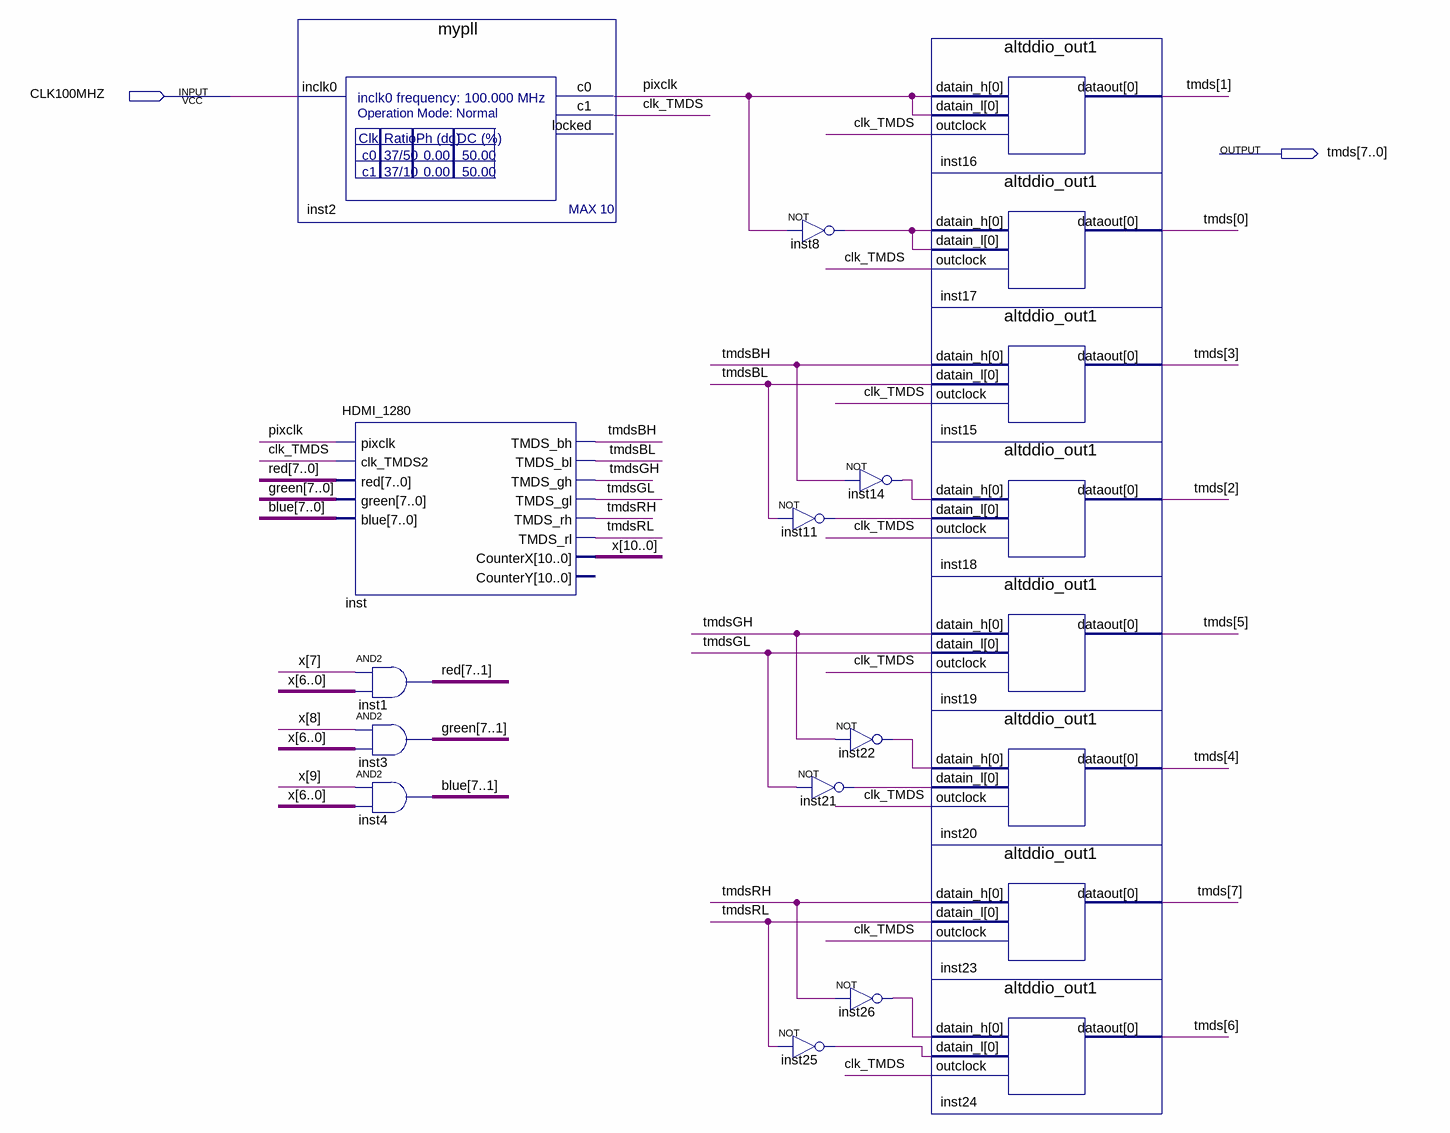
[diagram p0: schematic sheet]
// Quartus schematic max10.bdf as structural Verilog: 20 symbols, 2 pins
module max10 (
  input  CLK100MHZ,
  output [7:0] tmds
);

  wire clk_TMDS, inst8_out, inst11_out, inst14_out, inst21_out, inst22_out, inst25_out, inst26_out, pixclk,
       tmdsBH, tmdsBL, tmdsGH, tmdsGL, tmdsRH, tmdsRL;
  wire [7:0] blue, green, red;
  wire [10:0] x;

  mypll inst2 (.inclk0(CLK100MHZ), .c0(pixclk), .c1(clk_TMDS));  // open: locked
  HDMI_1280 inst (
    .pixclk(pixclk), .clk_TMDS2(clk_TMDS), .red(red), .green(green), .blue(blue), .TMDS_bh(tmdsBH),
    .TMDS_bl(tmdsBL), .TMDS_gh(tmdsGH), .TMDS_gl(tmdsGL), .TMDS_rh(tmdsRH), .TMDS_rl(tmdsRL), .CounterX(x));  // open: CounterY
  assign red[7:1] = {7{x[7]}} & x[6:0];  // AND2 inst1, 7 bits wide
  assign green[7:1] = {7{x[8]}} & x[6:0];  // AND2 inst3, 7 bits wide
  assign blue[7:1] = {7{x[9]}} & x[6:0];  // AND2 inst4, 7 bits wide
  not inst8 (inst8_out, pixclk);
  not inst11 (inst11_out, tmdsBL);
  not inst21 (inst21_out, tmdsGL);
  not inst25 (inst25_out, tmdsRL);
  not inst14 (inst14_out, tmdsBH);
  not inst22 (inst22_out, tmdsGH);
  not inst26 (inst26_out, tmdsRH);
  altddio_out1 inst16 (.datain_h(pixclk), .datain_l(pixclk), .outclock(clk_TMDS), .dataout(tmds[1]));
  altddio_out1 inst17 (.datain_h(inst8_out), .datain_l(inst8_out), .outclock(clk_TMDS), .dataout(tmds[0]));
  altddio_out1 inst15 (.datain_h(tmdsBH), .datain_l(tmdsBL), .outclock(clk_TMDS), .dataout(tmds[3]));
  altddio_out1 inst18 (.datain_h(inst14_out), .datain_l(inst11_out), .outclock(clk_TMDS), .dataout(tmds[2]));
  altddio_out1 inst19 (.datain_h(tmdsGH), .datain_l(tmdsGL), .outclock(clk_TMDS), .dataout(tmds[5]));
  altddio_out1 inst20 (.datain_h(inst22_out), .datain_l(inst21_out), .outclock(clk_TMDS), .dataout(tmds[4]));
  altddio_out1 inst23 (.datain_h(tmdsRH), .datain_l(tmdsRL), .outclock(clk_TMDS), .dataout(tmds[7]));
  altddio_out1 inst24 (.datain_h(inst26_out), .datain_l(inst25_out), .outclock(clk_TMDS), .dataout(tmds[6]));
endmodule
